# EAGLE design leds (EAGLE 7.2.0)
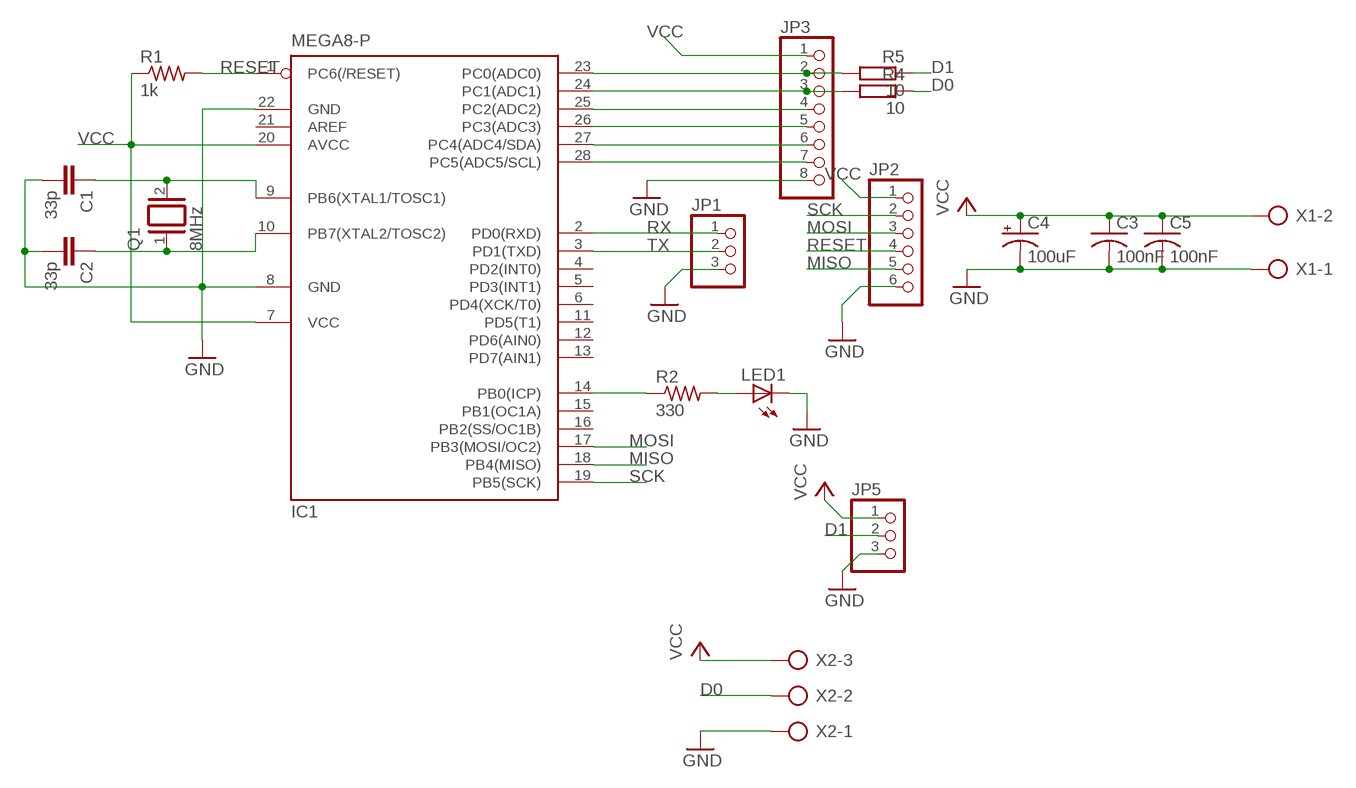
[diagram p0: schematic, sheet 1]

## Parts
C1  33p  C-EU025-025X050  [C025-025X050]
C2  33p  C-EU025-025X050  [C025-025X050]
C3  100nF  C-USC0805  [C0805]
C4  100uF  CPOL-USE5-8.5  [E5-8,5]
C5  100nF  C-USC0805  [C0805]
IC1  MEGA8-P  [DIL28-3]
JP1  PINHD-1X3  [1X03]
JP2  PINHD-1X6  [1X06]
JP3  PINHD-1X8  [1X08]
JP5  PINHD-1X3  [1X03]
LED1  LED3MM  [LED3MM]
Q1  8MHz  XTAL/S  [QS]
R1  1k  R-US_M0805  [M0805]
R2  330  R-US_M0805  [M0805]
R4  10  R-EU_0204/7  [0204/7]
R5  10  R-EU_0204/7  [0204/7]
X1  AK500/2  [AK500/2]
X2  AK500/3  [AK500/3]

## Nets
D0: R4.1 X2.2
D1: JP5.2 R5.1
GND: C1.2 C2.2 C3.2 C4.- C5.2 IC1.8(GND) IC1.22(GND) JP1.3 JP2.6 JP3.8 JP5.3 LED1.K(C) X1.1 X2.1
MISO: IC1.18(PB4(MISO)) JP2.5
MOSI: IC1.17(PB3(MOSI/OC2)) JP2.3
N$1: IC1.27(PC4(ADC4/SDA)) JP3.6
N$2: IC1.23(PC0(ADC0)) JP3.2 R5.2
N$3: C1.1 IC1.9(PB6(XTAL1/TOSC1)) Q1.2
N$4: C2.1 IC1.10(PB7(XTAL2/TOSC2)) Q1.1
N$5: IC1.24(PC1(ADC1)) JP3.3 R4.2
N$6: IC1.25(PC2(ADC2)) JP3.4
N$7: IC1.26(PC3(ADC3)) JP3.5
N$8: IC1.28(PC5(ADC5/SCL)) JP3.7
N$10: IC1.14(PB0(ICP)) R2.1
N$11: LED1.A R2.2
RESET: IC1.1(PC6(/RESET)) JP2.4 R1.2
RX: IC1.2(PD0(RXD)) JP1.1
SCK: IC1.19(PB5(SCK)) JP2.2
TX: IC1.3(PD1(TXD)) JP1.2
VCC: C3.1 C4.+ C5.1 IC1.7(VCC) IC1.20(AVCC) JP2.1 JP3.1 JP5.1 R1.1 X1.2 X2.3
Unconnected: IC1.4(PD2(INT0)) IC1.5(PD3(INT1)) IC1.6(PD4(XCK/T0)) IC1.11(PD5(T1)) IC1.12(PD6(AIN0)) IC1.13(PD7(AIN1)) IC1.15(PB1(OC1A)) IC1.16(PB2(SS/OC1B)) IC1.21(AREF)

## Library data of the parts
C1 C2 = rcl:C-EU: CAPACITOR, European symbol
C3 C5 = rcl:C-US: CAPACITOR, American symbol
C4 = rcl:CPOL-US: POLARIZED CAPACITOR, American symbol
IC1 = atmel:MEGA8-P: MICROCONTROLLER 8 Kbytes FLASH, 1 kbytes SRAM, 512 bytes EEPROM, USART, 4-channel 10 bit ADC, 2-channel 8 bit ADC Pin compatible with Atmega48, ATMega88, ATMega168 Source: avr.lbr; OC_FARNELL: unknown; OC_NEWARK: unknown
JP1 JP5 = pinhead:PINHD-1X3: PIN HEADER
JP2 = pinhead:PINHD-1X6: PIN HEADER
JP3 = pinhead:PINHD-1X8: PIN HEADER
LED1 = led:LED: LED OSRAM: - CHIPLED LG R971, LG N971, LY N971, LG Q971, LY Q971, LO R971, LY R971 LH N974, LH R974 LS Q976, LO Q976, LY Q976 LO Q996 - Hyper CHIPLED LW Q18S LB Q993, LB Q99A, LB R99A - SideLED LS A670, LO A670, LY A670, LG A670, LP A670 LB A673, LV A673, LT A673, LW A673 LH A674 LY A675 LS A676, LA A676, LO A676, LY A676, LW A676 LS A679, LY A679, LG A679 - Hyper Micro SIDELED® LS Y876, LA Y876, LO Y876, LY Y876 LT Y87S - SmartLED LW L88C, LW L88S LB L89C, LB L89S, LG L890 LS L89K, LO L89K, LY L89K LS L896, LA L896, LO L896, LY L896 - TOPLED LS T670, LO T670, LY T670, LG T670, LP T670 LSG T670, LSP T670, LSY T670, LOP T670, LYG T670 LG T671, LOG T671, LSG T671 LB T673, LV T673, LT T673, LW T673 LH T674 LS T676, LA T676, LO T676, LY T676, LB T676, LH T676, LSB T676, LW T676 LB T67C, LV T67C, LT T67C, LS T67K, LO T67K, LY T67K, LW E67C LS E67B, LA E67B, LO E67B, LY E67B, LB E67C, LV E67C, LT E67C LW T67C LS T679, LY T679, LG T679 LS T770, LO T770, LY T770, LG T770, LP T770 LB T773, LV T773, LT T773, LW T773 LH T774 LS E675, LA E675, LY E675, LS T675 LS T776, LA T776, LO T776, LY T776, LB T776 LHGB T686 LT T68C, LB T68C - Hyper Mini TOPLED® LB M676 - Mini TOPLED Santana® LG M470 LS M47K, LO M47K, LY M47K Source: http://www.osram.convergy.de LUXEON: - LUMILED® LXK2-PW12-R00, LXK2-PW12-S00, LXK2-PW14-U00, LXK2-PW14-V00 LXK2-PM12-R00, LXK2-PM12-S00, LXK2-PM14-U00 LXK2-PE12-Q00, LXK2-PE12-R00, LXK2-PE12-S00, LXK2-PE14-T00, LXK2-PE14-U00 LXK2-PB12-K00, LXK2-PB12-L00, LXK2-PB12-M00, LXK2-PB14-N00, LXK2-PB14-P00, LXK2-PB14-Q00 LXK2-PR12-L00, LXK2-PR12-M00, LXK2-PR14-Q00, LXK2-PR14-R00 LXK2-PD12-Q00, LXK2-PD12-R00, LXK2-PD12-S00 LXK2-PH12-R00, LXK2-PH12-S00 LXK2-PL12-P00, LXK2-PL12-Q00, LXK2-PL12-R00 Source: www.luxeon.com KINGBRIGHT: KA-3528ASYC Source: www.kingbright.com
Q1 = special:XTAL/S: CRYSTAL
R1 R2 = rcl:R-US_: RESISTOR, American symbol
R4 R5 = rcl:R-EU_: RESISTOR, European symbol
X1 = con-ptr500:AK500/2: CONNECTOR; OC_FARNELL: unknown; OC_NEWARK: unknown
X2 = con-ptr500:AK500/3: CONNECTOR; OC_FARNELL: unknown; OC_NEWARK: unknown

## Board
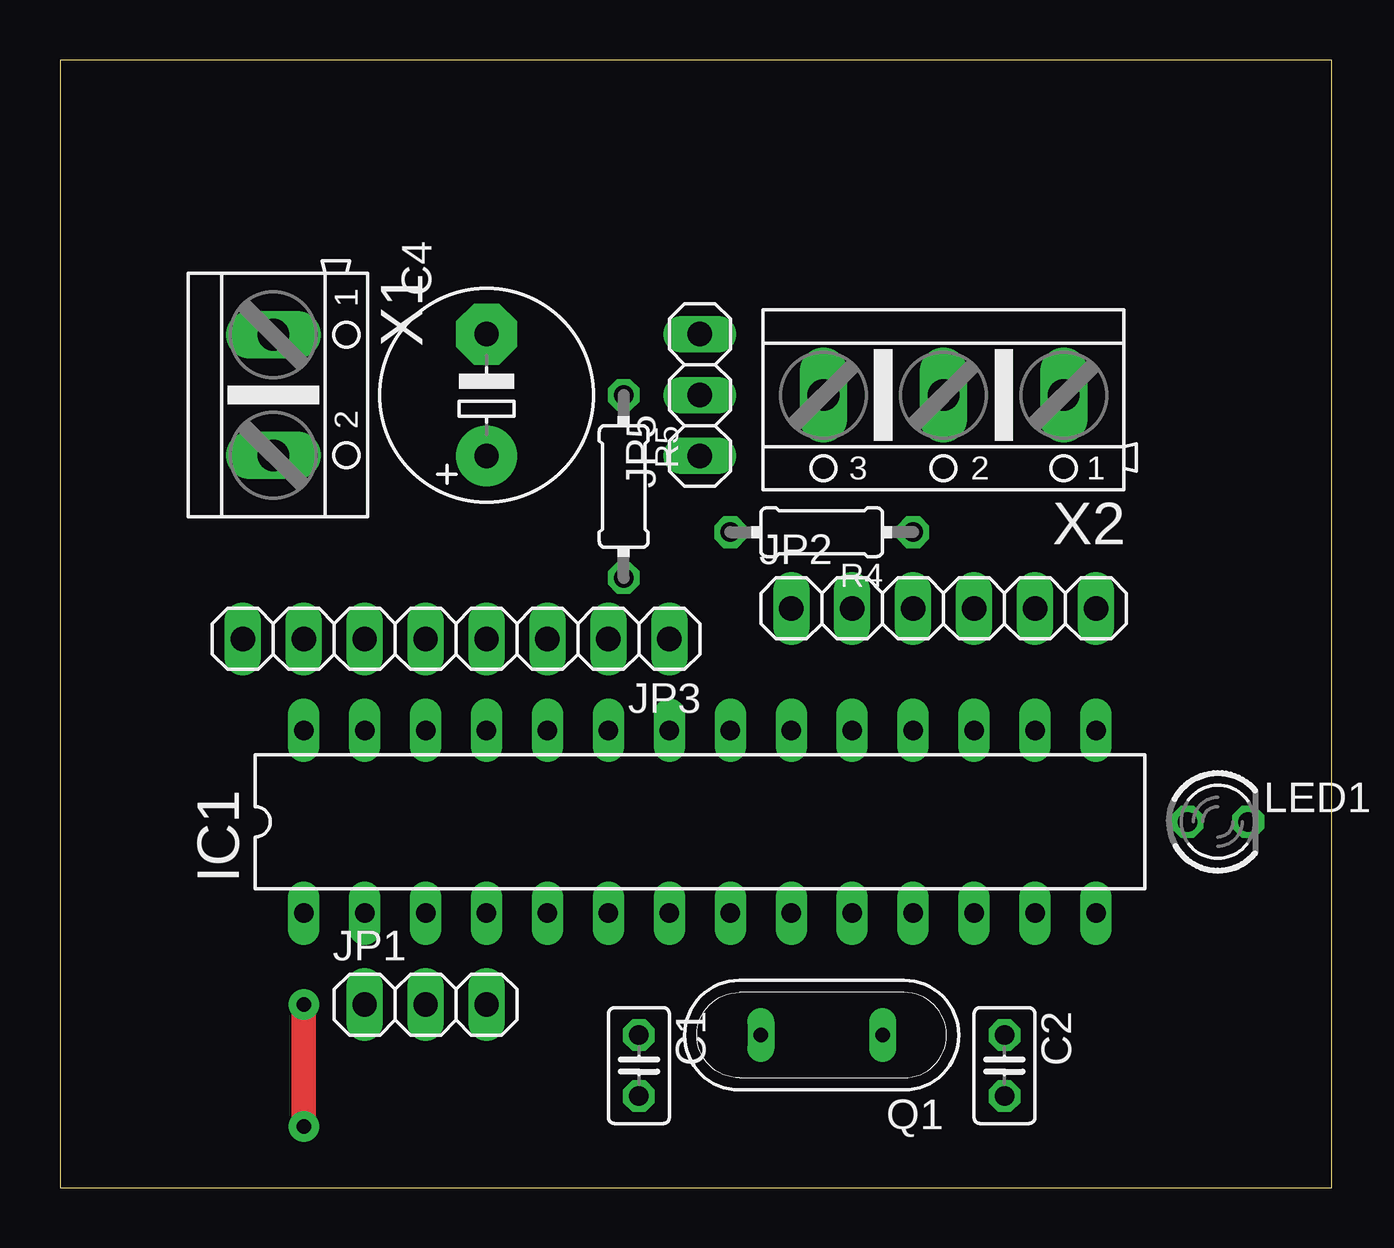
[diagram p1: board, top side]
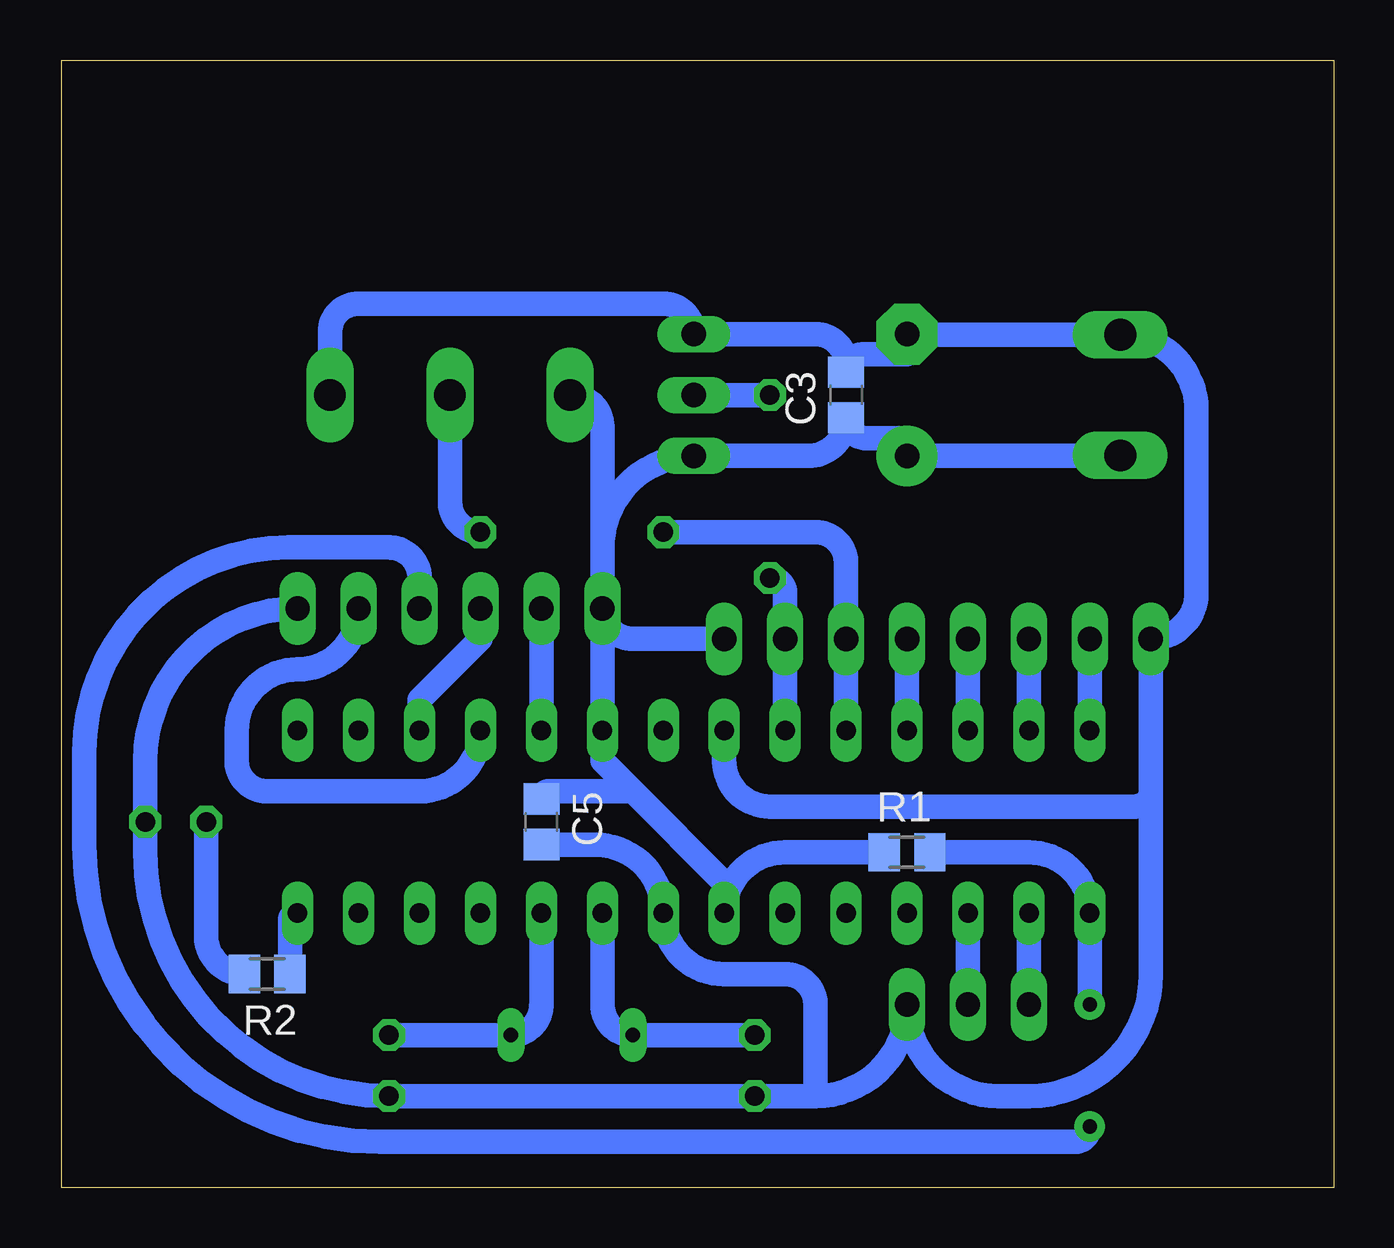
[diagram p2: board, bottom side, seen from below]

Size 53.01 x 46.98 mm. Coordinates in mm from the lower left corner, seen from the top.
Outline: 0,0 53.01,0 53.01,46.98 0,46.98 0,0
Copper layers (1*16): Top 0.035mm / dielectric 1.5mm / Bottom 0.035mm
Design rules "default": minimum track width 10mil, minimum drill 24mil, track to track 8mil, track to pad 8mil, pad to pad 8mil, via to via 8mil, smd to smd 8mil, copper to edge 40mil, drill to drill 8mil, minimum pad ring 10mil, minimum via ring 8mil, stop-mask expansion 4mil, vias tented up to drill 0mil, thermal gap 10mil

### Footprints (pad centres in the part's own frame; a part is rotated, then mirrored left to right if it is on the bottom)
C025-025X050 = drill 0.813 octagon: 1 -1.27,0; 2 1.27,0
C0805 = smd 1.3 x 1.5: 1 -0.95,0; 2 0.95,0
E5-8,5 = drill 1.016 pad 2.54: + -2.54,0 | drill 1.016 pad 2.54 octagon: - 2.54,0
DIL28-3 = drill 0.813 long: 1 -16.51,-3.81; 2 -13.97,-3.81; 3 -11.43,-3.81; 4 -8.89,-3.81; 5 -6.35,-3.81; 6 -3.81,-3.81; 7 -1.27,-3.81; 8 1.27,-3.81; 9 3.81,-3.81; 10 6.35,-3.81; 11 8.89,-3.81; 12 11.43,-3.81; 13 13.97,-3.81; 14 16.51,-3.81; 15 16.51,3.81; 16 13.97,3.81; 17 11.43,3.81; 18 8.89,3.81; 19 6.35,3.81; 20 3.81,3.81; 21 1.27,3.81; 22 -1.27,3.81; 23 -3.81,3.81; 24 -6.35,3.81; 25 -8.89,3.81; 26 -11.43,3.81; 27 -13.97,3.81; 28 -16.51,3.81
1X03 = drill 1.016 long: 1 -2.54,0; 2 0,0; 3 2.54,0
1X06 = drill 1.016 long: 1 -6.35,0; 2 -3.81,0; 3 -1.27,0; 4 1.27,0; 5 3.81,0; 6 6.35,0
1X08 = drill 1.016 long: 1 -8.89,0; 2 -6.35,0; 3 -3.81,0; 4 -1.27,0; 5 1.27,0; 6 3.81,0; 7 6.35,0; 8 8.89,0
LED3MM = drill 0.813 octagon: A -1.27,0; K 1.27,0
QS = drill 0.61 long: 1 -2.54,0; 2 2.54,0
M0805 = smd 1.3 x 1.6: 1 -0.95,0; 2 0.95,0
0204/7 = drill 0.813 octagon: 1 -3.81,0; 2 3.81,0
AK500/2 = drill 1.321 long: 1 -2.515,0; 2 2.515,0
AK500/3 = drill 1.321 long: 1 -5.004,0; 2 0,0; 3 5.004,0

### Placement (x,y rotation side)
C1  24.13,5.08 270 top
C2  39.37,5.08 270 top
C3  20.32,33.02 90 bottom
C4  17.78,33.02 90 top
C5  33.02,15.24 270 bottom
IC1  26.67,15.24 0 top
JP1  15.24,7.62 0 top
JP2  36.83,24.13 0 top
JP3  16.51,22.86 180 top
JP5  26.67,33.02 90 top
LED1  48.26,15.24 0 top
Q1  31.75,6.35 180 top
R1  17.78,13.97 0 bottom
R2  44.45,8.89 180 bottom
R4  31.75,27.3 180 top
R5  23.5,29.21 270 top
X1  8.89,33.02 270 top
X2  36.83,33.02 180 top

### Tracks (layer width: path | path; a pad name or v marks a point on that pad's centre or on a via)
D0
  Bottom 1.016: R4.1 arc90 36.83,28.57 X2.2
D1
  Bottom 1.016: R5.1 JP5.2
GND
  Bottom 1.016: 21.59,3.81 arc-90 JP1.3 arc-90 13.97,3.81 12.7,3.81 arc-90 7.62,8.89 7.62,16.51 | 21.59,3.81 C1.2 C2.2 arc90 49.53,13.97 LED1.K 49.53,17.78 arc90 JP2.6 | 21.59,3.81 21.59,7.62 arc-90 22.86,8.89 25.4,8.89 arc90 IC1.8 arc-90 30.8,14.29 C5.2 | 7.62,16.51 JP3.8 arc-90 5.71,24.77 5.71,32.38 arc-90 8.87,35.53 X1.1 17.78,35.53 C4.- 17.78,34.72 19.57,34.72 arc-90 C3.2 20.32,34.29 arc-90 21.59,35.56 JP5.3 arc-90 27.94,36.83 40.64,36.83 arc-90 41.83,35.64 X2.1 | IC1.22 25.4,17.78 arc-90 23.5,15.88 8.26,15.88 arc-90 7.62,16.51
MISO
  Bottom 1.016: IC1.18 arc90 38.1,16.51 44.45,16.51 arc90 45.72,17.78 45.72,19.05 arc90 43.18,21.59 arc-90 JP2.5
MOSI
  Bottom 1.016: IC1.17 38.1,20.32 35.56,22.86 JP2.3
N$1
  Bottom 1.016: JP3.6 IC1.27
N$2
  Bottom 1.016: IC1.23 JP3.2 22.86,24.77 arc-90 R5.2
N$3
  Bottom 1.016: IC1.9 30.48,7.62 arc-90 Q1.2 C1.1
N$4
  Bottom 1.016: IC1.10 33.02,7.62 arc90 Q1.1 C2.1
N$5
  Bottom 1.016: IC1.24 JP3.3 20.32,26.04 arc-90 21.59,27.3 R4.2
N$6
  Bottom 1.016: JP3.4 IC1.25
N$7
  Bottom 1.016: JP3.5 IC1.26
N$8
  Bottom 1.016: JP3.7 IC1.28
N$10
  Bottom 1.016: IC1.14 arc-90 43.5,11.11 R2.1
N$11
  Bottom 1.016: R2.2 arc90 46.99,10.48 LED1.A
RESET  (via drill 0.6 pad 1.27)
  Top 1.016: v10.16,7.62 v10.16,2.54
  Bottom 1.016: R1.2 12.7,13.97 arc90 IC1.1 v10.16,7.62 | v10.16,2.54 arc90 10.79,1.91 39.74,1.91 arc90 52.07,14.23 52.07,18.15 arc90 43.55,26.67 39.37,26.67 arc90 38.1,25.4 JP2.4
RX
  Bottom 1.016: JP1.1 IC1.2
SCK
  Bottom 1.016: IC1.19 JP2.2
TX
  Bottom 1.016: JP1.2 IC1.3
VCC
  Bottom 1.016: R1.1 22.86,13.97 arc-90 IC1.7 25.4,12.7 29.21,16.51 | 29.21,16.51 30.48,17.78 IC1.20 JP2.1 | C5.1 arc90 32.7,16.51 29.21,16.51 | JP3.1 29.21,22.86 arc90 JP2.1 | X1.2 8.89,30.48 C4.+ 17.78,31.22 19.47,31.22 arc90 C3.1 arc90 21.91,30.48 JP5.1 arc-90 30.48,26.67 JP2.1 | X2.3 arc90 30.48,31.67 JP2.1